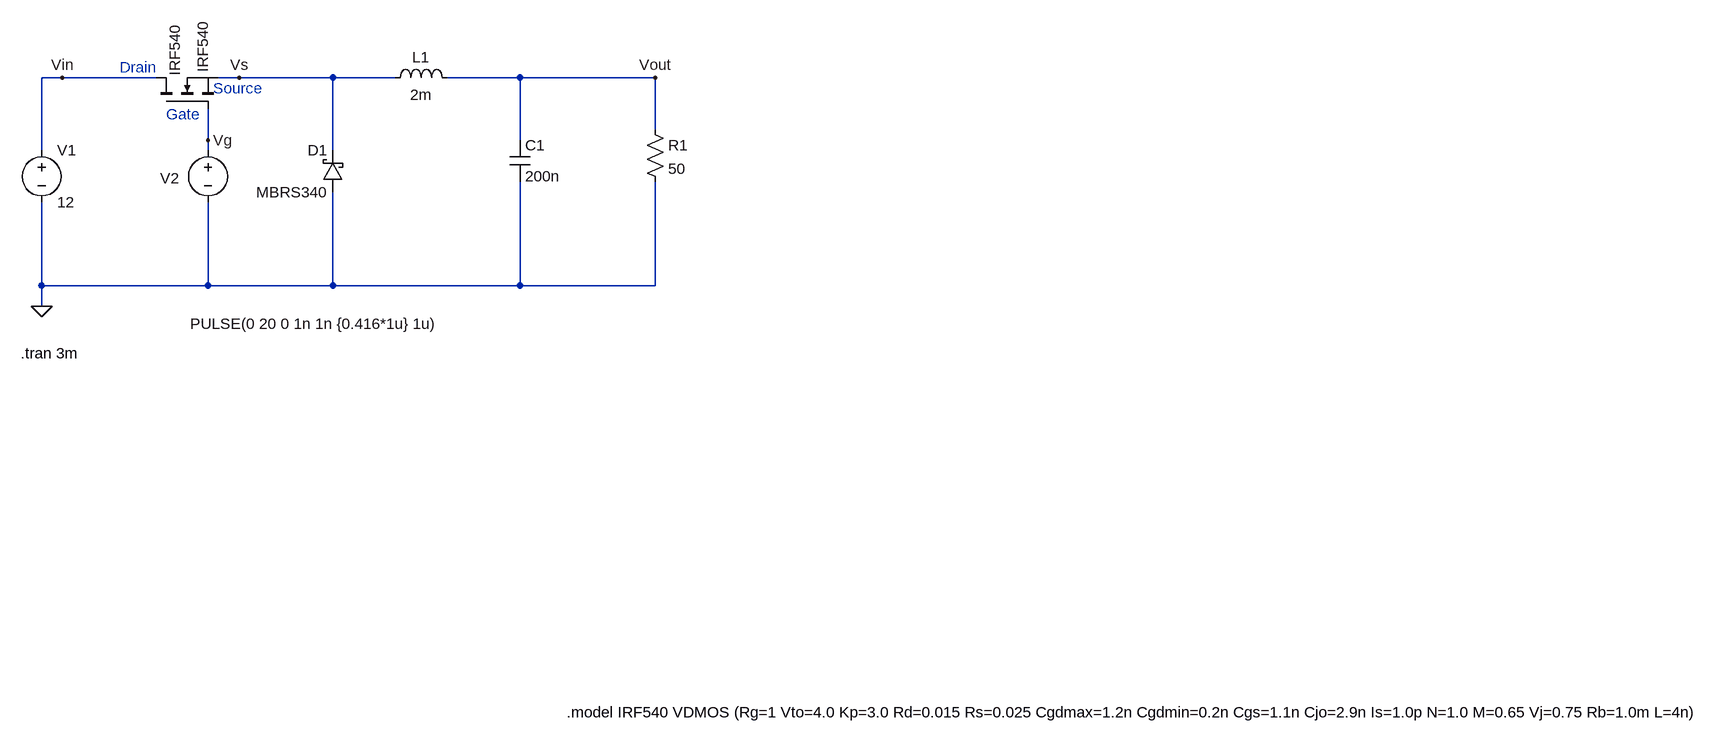
[diagram p0: schematic buck_converter_Mosfet-Diodo.asc]
buck_converter_Mosfet-Diodo.asc, the LTspice schematic file:
Version 4
SHEET 1 3028 1488
WIRE -16 48 -48 48
WIRE 128 48 -16 48
WIRE 256 48 224 48
WIRE 400 48 256 48
WIRE 496 48 400 48
WIRE 688 48 576 48
WIRE 896 48 688 48
WIRE 896 128 896 48
WIRE 208 144 208 96
WIRE 688 144 688 48
WIRE -48 160 -48 48
WIRE 208 160 208 144
WIRE 400 160 400 48
WIRE -48 368 -48 240
WIRE 208 368 208 240
WIRE 208 368 -48 368
WIRE 400 368 400 224
WIRE 400 368 208 368
WIRE 688 368 688 208
WIRE 688 368 400 368
WIRE 896 368 896 208
WIRE 896 368 688 368
WIRE -48 400 -48 368
FLAG -48 400 0
FLAG 896 48 Vout
FLAG 208 144 Vg
FLAG -16 48 Vin
FLAG 256 48 Vs
SYMBOL voltage -48 144 R0
WINDOW 123 0 0 Left 0
WINDOW 39 0 0 Left 0
SYMATTR InstName V1
SYMATTR Value 12
SYMBOL nmos 128 96 R270
WINDOW 0 51 29 Left 2
SYMATTR InstName IRF540
SYMATTR Value IRF540
SYMBOL schottky 416 224 R180
WINDOW 0 24 64 Left 2
WINDOW 3 24 0 Left 2
SYMATTR InstName D1
SYMATTR Value MBRS340
SYMATTR Description Diode
SYMATTR Type diode
SYMBOL ind 480 64 R270
WINDOW 0 32 56 VTop 2
WINDOW 3 5 56 VBottom 2
SYMATTR InstName L1
SYMATTR Value 2m
SYMBOL cap 672 144 R0
SYMATTR InstName C1
SYMATTR Value 200n
SYMBOL res 880 112 R0
SYMATTR InstName R1
SYMATTR Value 50
SYMBOL voltage 208 144 R0
WINDOW 0 -59 43 Top 2
WINDOW 3 164 298 Bottom 2
WINDOW 123 0 0 Left 0
WINDOW 39 0 0 Left 0
SYMATTR InstName V2
SYMATTR Value PULSE(0 20 0 1n 1n {0.416*1u} 1u)
TEXT 216 64 Left 2 ;Source
TEXT 144 104 Left 2 ;Gate
TEXT 72 32 Left 2 ;Drain
TEXT -80 472 Left 2 !.tran 3m
TEXT 760 1024 Left 2 !.model IRF540 VDMOS (Rg=1 Vto=4.0 Kp=3.0 Rd=0.015 Rs=0.025 Cgdmax=1.2n Cgdmin=0.2n Cgs=1.1n Cjo=2.9n Is=1.0p N=1.0 M=0.65 Vj=0.75 Rb=1.0m L=4n)

The netlist it stands for:
* buck_converter_Mosfet-Diodo.asc
V1 Vin 0 12
M§IRF540 Vin Vg Vs Vs IRF540
D1 0 Vs MBRS340
L1 Vs Vout 2m
C1 Vout 0 200n
R1 Vout 0 50
V2 Vg 0 PULSE(0 20 0 1n 1n {0.416*1u} 1u)
.model D D
.lib standard.dio
.model NMOS NMOS
.model PMOS PMOS
.lib standard.mos
* Source
* Gate
* Drain
.tran 3m
.model IRF540 VDMOS (Rg=1 Vto=4.0 Kp=3.0 Rd=0.015 Rs=0.025 Cgdmax=1.2n Cgdmin=0.2n Cgs=1.1n Cjo=2.9n Is=1.0p N=1.0 M=0.65 Vj=0.75 Rb=1.0m L=4n)
.backanno
.end